# Altium project Fish_Feeder.PrjPcb
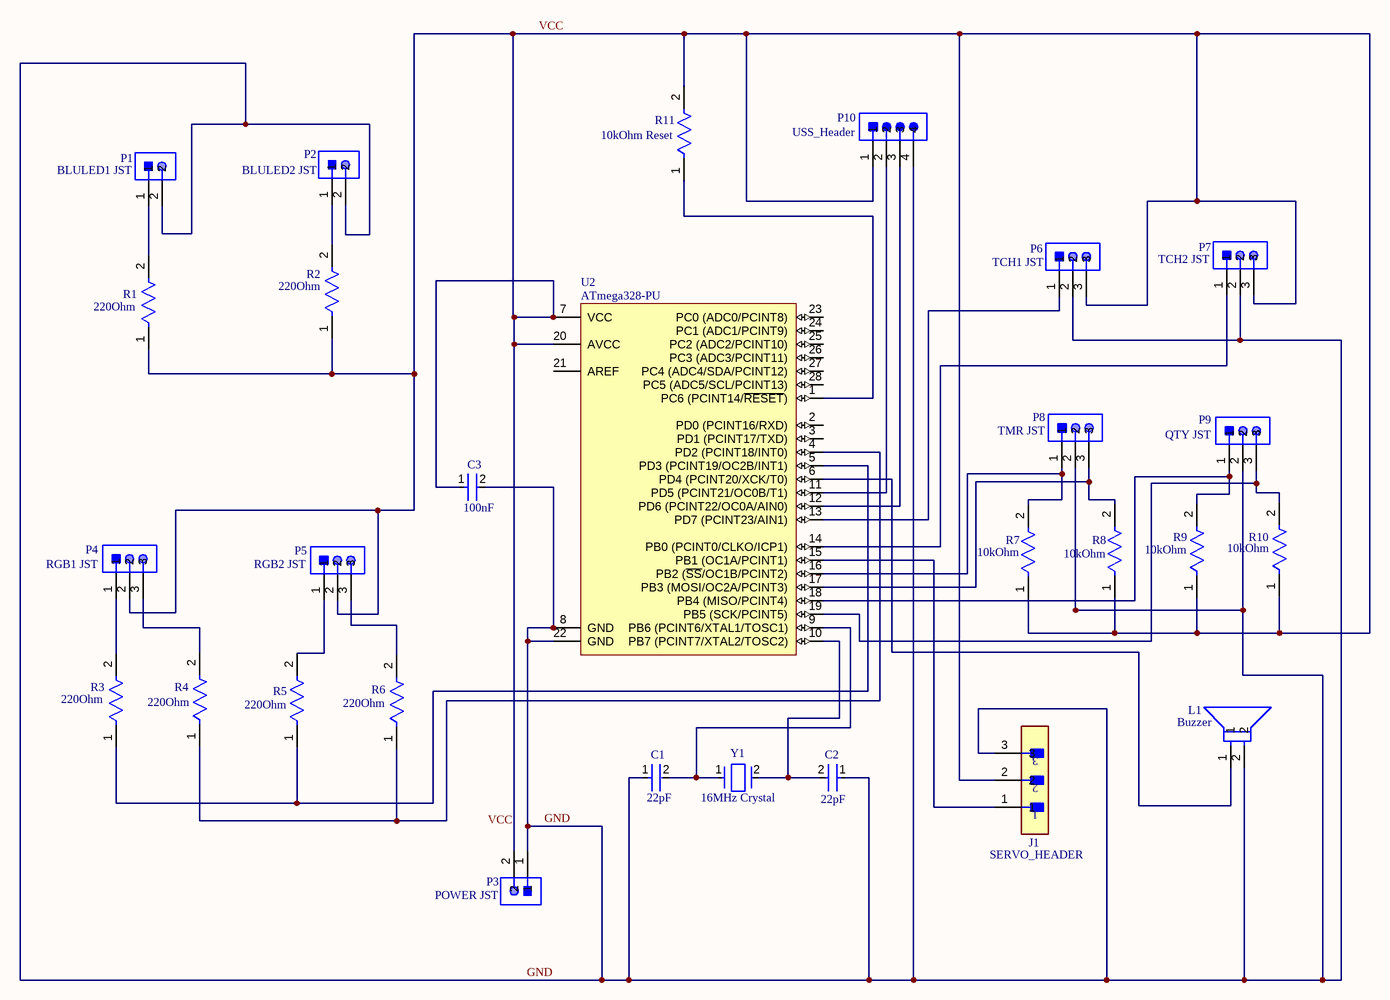
[diagram p0: Fish_Feeder_Schematic.SchDoc]
1 sheet, 28 parts. Net scope: global (net labels, ports and power ports of the same name join across sheets).
Board file: Fish_Feeder_PCB.PcbDoc

## Sheet Fish_Feeder_Schematic.SchDoc
size 431 x 279 mm; SheetNumber: 1; SheetTotal: 1

### Parts
C1  22pF  [FP-VY1470-MFG]
C2  22pF  [FP-VY1470-MFG]
C3  100nF  [FP-VY1470-MFG]
J1  SERVO_HEADER  [FP-87224-3-MFG]
L1  Buzzer  [FP-PS1440P02BT-MFG]
P1  BLULED1 JST  [JST-S2B-PH-K-S_V]
P2  BLULED2 JST  [JST-S2B-PH-K-S_V]
P3  POWER JST  [JST-S2B-PH-K-S_V]
P4  RGB1 JST  [JST-B3B-PH-K-S-3_V]
P5  RGB2 JST  [JST-B3B-PH-K-S-3_V]
P6  TCH1 JST  [JST-B3B-PH-K-S-3_V]
P7  TCH2 JST  [JST-B3B-PH-K-S-3_V]
P8  TMR JST  [JST-B3B-PH-K-S-3_V]
P9  QTY JST  [JST-B3B-PH-K-S-3_V]
P10  USS_Header  [TECO-640456-4]
R1  220Ohm  [FP-CFR-25-MFG]
R2  220Ohm  [FP-CFR-25-MFG]
R3  220Ohm  [FP-CFR-25-MFG]
R4  220Ohm  [FP-CFR-25-MFG]
R5  220Ohm  [FP-CFR-25-MFG]
R6  220Ohm  [FP-CFR-25-MFG]
R7  10kOhm  [FP-CFR-25-MFG]
R8  10kOhm  [FP-CFR-25-MFG]
R9  10kOhm  [FP-CFR-25-MFG]
R10  10kOhm  [FP-CFR-25-MFG]
R11  10kOhm Reset  [FP-CFR-25-MFG]
U2  ATmega328-PU  [28P3]
Y1  16MHz Crystal  [FP-ABL-MFG]

### Nets
GND: C1.1 C2.1 C3.2 J1.3 L1.2 P1.2 P2.2 P3.1 P6.2 P7.2 P8.2 P9.2 P10.4 U2.8(GND) U2.22(GND)
VCC: C3.1 J1.2 P3.2 P4.2 P5.2 P6.3 P7.3 P10.1 R1.1 R2.1 R7.1 R8.1 R9.1 R10.1 R11.2 U2.7(VCC) U2.20(AVCC)
NetC1_2: C1.2 U2.9(PB6_(PCINT6/XTAL1/TOSC1)) Y1.1
NetC2_2: C2.2 U2.10(PB7_(PCINT7/XTAL2/TOSC2)) Y1.2
NetJ1_1: J1.1 U2.15(PB1_(OC1A/PCINT1))
NetL1_1: L1.1 U2.6(PD4_(PCINT20/XCK/T0))
NetP1_1: P1.1 R1.2
NetP2_1: P2.1 R2.2
NetP4_1: P4.1 R3.2
NetP4_3: P4.3 R4.2
NetP5_1: P5.1 R5.2
NetP5_3: P5.3 R6.2
NetP6_1: P6.1 U2.13(PD7_(PCINT23/AIN1))
NetP7_1: P7.1 U2.14(PB0_(PCINT0/CLKO/ICP1))
NetP8_1: P8.1 R7.2 U2.16(PB2_(~{SS}/OC1B/PCINT2))
NetP8_3: P8.3 R8.2 U2.17(PB3_(MOSI/OC2A/PCINT3))
NetP9_1: P9.1 R9.2 U2.18(PB4_(MISO/PCINT4))
NetP9_3: P9.3 R10.2 U2.19(PB5_(SCK/PCINT5))
NetP10_2: P10.2 U2.11(PD5_(PCINT21/OC0B/T1))
NetP10_3: P10.3 U2.12(PD6_(PCINT22/OC0A/AIN0))
NetR3_1: R3.1 R5.1 U2.5(PD3_(PCINT19/OC2B/INT1))
NetR4_1: R4.1 R6.1 U2.4(PD2_(PCINT18/INT0))
NetR11_1: R11.1 U2.1(PC6_(PCINT14/~{RESET}))

Not connected (* = marked no-connect by the designer): U2 2(PD0_(PCINT16/RXD)) 3(PD1_(PCINT17/TXD)) 21(AREF) 23(PC0_(ADC0/PCINT8)) 24(PC1_(ADC1/PCINT9)) 25(PC2_(ADC2/PCINT10)) 26(PC3_(ADC3/PCINT11)) 27(PC4_(ADC4/SDA/PCINT12)) 28(PC5_(ADC5/SCL/PCINT13))

### Notes on the sheet
- DWG. NO.
- REV.
- SHT.
- THIS DOCUMENT AND THE DATA DISCLOSED HEREIN OR HEREWITH IS THE PROPERTY OF ALTIUM LIMITED AND MAY BE FREELY DISTRIBUTED IN WHOLE. NO RIGHTS ARE RESERVED OR EXPRESS OR IMPLIED WARANTEE GIVEN.
- REVISION
- DESCRIPTION
- DATE
- APPROVED
- ENG:
- APPROVALS
- PROJECT
- DSN:
- CHK:
- REFERENCE DOCUMENTS
- PROJECT REVISION:
- TITLE
- DOCUMENT REVISION:
- DESIGN ITEM:
- BOM:
- FAB DWG:
- PCB DWG:
- ASSY DWG:
- SCALE:
- SIZE
- B
- CAGE CODE
- FILE NAME
- DWG NO.
- SHEET
- OF
- REV

### Library data of the parts
C1-C3 = CMP-02417-000069-1: CAP CER 2200PF 760VAC Y5U RADIAL; Capacitance: 2.2nF; Lead Diameter: 0.6mm; Ratings: X1; Voltage Rating (AC): 500V; Lead/Base Style: Kinked; Tolerance: 20%; Max Operating Temperature: 125°C; Resistor Type: Ceramic; Contact Plating: Tin; Thickness: 5mm; Width: 5mm; Min Operating Temperature: -40°C; Depth: 5mm; Mount: Through Hole; Termination: Radial; Lead Free: Lead Free; Diameter: 12mm; Height: 15mm; Radiation Hardening: No; Lead Pitch: 10mm; Case/Package: Radial; RoHS Compliant: Yes; Series: VY1; Dielectric: Y5U; Construction: RADIAL; Voltage: 500V; Voltage Rating (DC): 500V; Packaging: Tape and Reel; Height - Seated (Max): 0.63inch; Package Quantity: 500
J1 = CMP-2000-05697-2: CONN HEADER VERT 3POS 2.54MM; Number of Positions: 3; Gasket: No (Without); High Speed Serial Data Connector: No; Current Rating: 3A; Contact Post Length: 0.125inch; PCB Thickness: 1.397mm; PCB Mount Retention: Without; Connector Type: Plug; Approvals: CSA; PCB Mounting Orientation: Vertical; Pitch: 2.54mm; Mating Alignment: No (Without); Housing Color: Black; Contact Gender: Male; Length: 7.21mm; Max Operating Temperature: 105°C; Strain Relief: No (Without); Contact Material: Bronze; Row Spacing: 2.54mm; Series: AMPMODU MOD II; Board Standoff: No (Without); Package Quantity: 520; Radiation Hardening: No; Contact Protection: No (Without); Stabilizers: No (Without); Number of Rows: 1; Contact Mating Length: 8.08mm; Contact Shape: Square; Depth: 2.54mm; Contact Current Rating: 3A; Flammability Rating: UL94 V-0; Packaging: Carton; Number of Contacts: 3; Orientation: Straight; Mount: Through Hole; Keyed: No; Contact Type: Male Pin; Housing Material: Thermoplastic; High Temperature Housing: No; ELV: Compliant; Contact Plating: Gold; Termination: Through Hole; Selectively Loaded: No (Without); Lead Free: Lead Free; Min Operating Temperature: -65°C; Mating Connector Lock: No (Without); Color: Black; RoHS Compliant: Yes
L1 = CMP-08413-000003-1: AUDIO PIEZO TRANSDUCER 30V TH; Self Resonant Frequency: 4kHz; Washable: No; Voltage Rating (DC): 3V; Number of Terminals/Pins: 2; Packaging: Tape and Reel; Lead Free: Lead Free; Min Operating Temperature: -10°C; Package Quantity: 350; Termination: PC Pins; Mount: Through Hole; Max Operating Temperature: 70°C; Operating Supply Voltage: 3V; Diameter: 14mm; RoHS Compliant: Yes; Frequency: 4kHz; Height: 8mm
P1-P3 = CMP-1755-00004-1: Male Header, Pitch 2 mm, 1 x 2 Position, Height 4.8 mm, Tail Length 3.4 mm, -25 to 85 degC, RoHS, Bulk; Case\Package: Radial; Tolerance: 20%; Capacitance: 10 uF; Voltage Rating (DC): 50 V; Packaging: Bulk; ComponentLink1URL: http://www.jst-mfg.com/product/pdf/eng/ePH.pdf; Radiation Hardening: No; Height: 11 mm; Package Quantity: 200; PackageDescription: Male Header, Pitch 2 mm, 1 x 2 Position, Height 4.8 mm, Tail Length 3.4 mm; PackageReference: S2B-PH-K-S; Diameter: 5 mm; Pins: 2; Mount: Through Hole; Max Operating Temperature: 85 degC; Min Operating Temperature: -40 degC; ComponentLink1Description: Datasheet; DatasheetVersion: Dec-12; Length: 11 mm; Lead Pitch: 2 mm; REACH SVHC: No SVHC; Voltage Rating: 50 V; RoHSCompliant: true
P4-P9 = CMP-2000-05164-1: Male Header, Pitch 2 mm, 1 x 3 Position, Height 6 mm, Tail Length 3.4 mm, -25 to 85 degC, RoHS, Bulk; Style/Orientation: StraightHeader/Plug; Pitch: 2mm; No of Positions: 3; Termination: Crimp; Manufacturer: JST; Manufacturer URL: http://www.jst.com/home2.html; Datasheet Version: Oct-06; Type: ShroudedHeader; Datasheet URL: https://datasheet.ciiva.com/11746/0900766b80826550-11746939.pdf
P10 = CMP-2000-05419-1: Male Header, Pitch 2.54 mm, 1 x 4 Position, Height 10.03 mm, Tail Length 3.56 mm, RoHS, Bulk; Manufacturer: TE Connectivity; Material, Housing: Polyester; Primary Type: InterconnectSystem; Mount Angle: Vertical; Color, Housing: White; Current, Rating: 5 / A; Agency Approvals: CSA,UL; Contact Termination Area Plating: Tin; Temperature, Operating: -55to+105 / degC; Standards: RoHSCompliant,ELVCompliant,UL94V-0; Number of Positions: 4; Brand/Series: MTA-100Series; Angle: Straight; Pin Spacing: 0.1 / "; Material, Contact: CopperAlloy; Connector Type: MTA-100; Special Features: Pinstrip; Mounting Hole Size: 0.04 / "; Contact Centerline Spacing: 0.100 / in.; Voltage, Rating: 250 / V; Manufacturer URL: http://www.te.com/; Length, Pin: 0.14 / "; Length, Overall: 0.4 / "; Color: White; Flammability Rating: UL94V-0; Mounting Type: PCMount; Termination: Solder; Datasheet URL: https://datasheet.ciiva.com/16286/eng-ds-82056-mta-0608-16286228.pdf; Number of Contacts: 4; Contact Shape: Square; Contact Mating Area Plating: Tin; Length, Terminal Post: 0.14 / in.; Size, Post: 0.025 / in.; Contact Plating: Tin; Type: PCBPlug; Datasheet Version: Dec-14; Number of Rows: 1
R1-R11 = CMP-03413-000009-1: RES 10 OHM 1/4W 5% AXIAL; Resistance: 10R; Temperature Coefficient: 500ppm/°C; Max Power Dissipation: 250mW; RoHS Compliant: Yes; Packaging: Bulk; Series: Carbon Film; Case/Package: Axial; Max Operating Temperature: 155°C; Min Operating Temperature: -55°C; Number of Terminations: 2; Length: 0.248inch; Resistor Type: Carbon Film; Tolerance: 5%; Package Quantity: 200
U2 = CMP-0095-00015-2: 8-bit AVR Microcontroller, 32KB Flash, 1KB EEPROM, 2KB SRAM, 28-pin PDIP, Industrial Grade (-40°C to 85°C); ComponentLink3Description: ATmega48A/48PA/88A/88PA/168A/168PA/328/328P Summary; RevisionNote: DatasheetVersion updated. URLs added.; DatasheetVersion: revD, May-2011; ComponentLink1URL: http://www.atmel.com/; PackageVersion: revB, Sep-2001; PackageDescription: 28-lead (0.300"/7.62mm Wide) Plastic Dual Inline Package (PDIP); PackageReference: 28P3; ComponentLink1Description: Manufacturer URL; ComponentLink2Description: ATmega48A/48PA/88A/88PA/168A/168PA/328/328P Datasheet; ComponentLink3URL: http://www.atmel.com/dyn/resources/prod_documents/8271S.pdf; ComponentLink2URL: http://www.atmel.com/dyn/resources/prod_documents/8271.pdf
Y1 = CMP-27762-002521-1: CRYSTAL 16.0000MHZ 18PF TH; Capacitance: 1.8E-11F; Tolerance: 30ppm; ESR (Equivalent Series Resistance): 40R; Package Quantity: 200; Frequency: 16MHz; Min Operating Temperature: -20°C; Packaging: Bulk; Load Capacitance: 18pF; Height: 3.5mm; Max Operating Temperature: 70°C; Length: 11.5mm; Termination: Radial; Frequency Stability: 30ppm; Width: 5mm